# Altium schematic sheet 1_P1.schdoc: 戴尔服务器电源取电板
size 304 x 205 mm; Symbol: Altium_A4; Device: Altium_A4; Author: Tomosawa; ModifiedDate: 2024/6/10; Rule: 去除单片机影响
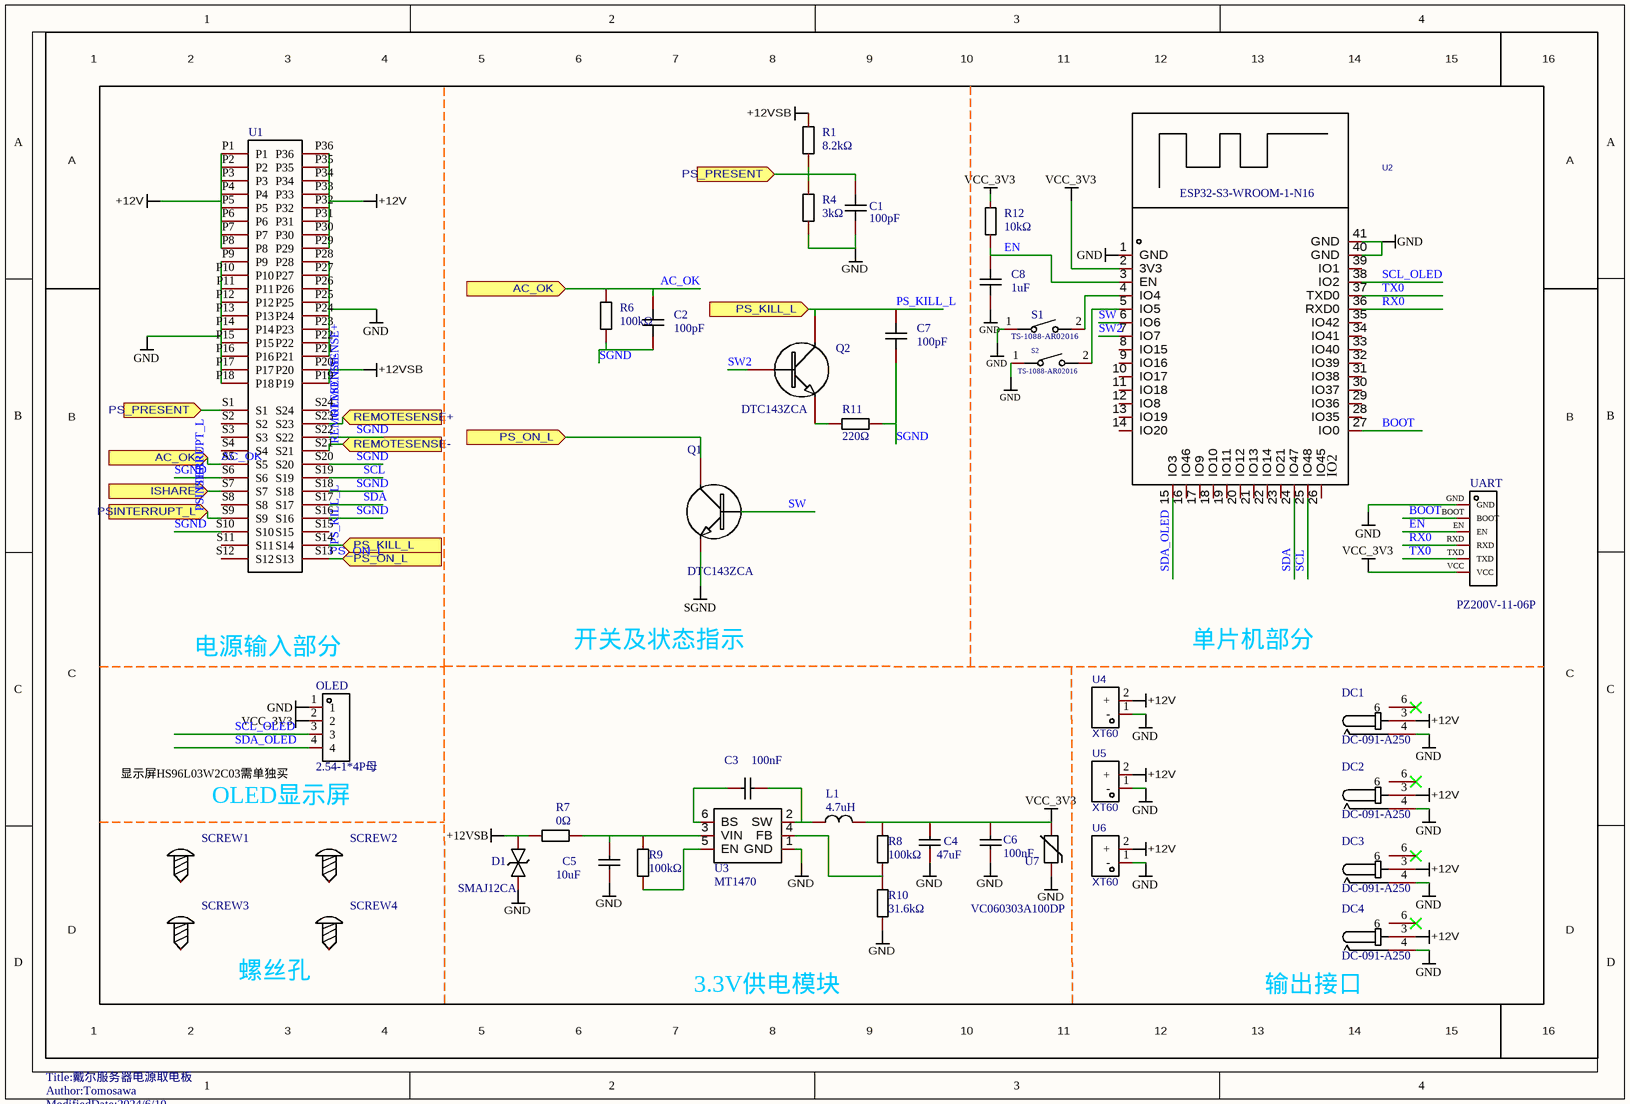
[diagram p0: 1_P1.schdoc]

## Parts
C1  100pF  [C0603]
C2  100pF  [C0603]
C3  100nF  [C0603]
C4  47uF  [C0805]
C5  10uF  [C0805]
C6  100nF  [C0603]
C7  100pF  [C0603]
C8  1uF  [C0603]
D1  SMAJ12CA  [SMA_L4.4-W2.6-LS5.0-BI]
DC1  DC-091-A250  [DC-IN-TH_DC-091-A250]
DC2  DC-091-A250  [DC-IN-TH_DC-091-A250]
DC3  DC-091-A250  [DC-IN-TH_DC-091-A250]
DC4  DC-091-A250  [DC-IN-TH_DC-091-A250]
L1  4.7uH  [IND-SMD_L3.0-W3.0_FNR30XXS]
OLED  2.54-1*4P母  [HDR-TH_4P-P2.54-V-F]
Q1  DTC143ZCA  [SOT-23-3_L2.9-W1.3-P1.90-LS2.4-BR]
Q2  DTC143ZCA  [SOT-23-3_L2.9-W1.3-P1.90-LS2.4-BR]
R1  8.2kΩ  [R0603]
R4  3kΩ  [R0603]
R6  100kΩ  [R0603]
R7  0Ω  [R0603]
R8  100kΩ  [R0603]
R9  100kΩ  [R0603]
R10  31.6kΩ  [R0603]
R11  220Ω  [R0603]
R12  10kΩ  [R0603]
S1  TS-1088-AR02016  [SW-SMD_L3.9-W3.0-P4.45]
S2  TS-1088-AR02016  [SW-SMD_L3.9-W3.0-P4.45]
SCREW1  M3螺丝  [M3螺丝]  (value not drawn)
SCREW2  M3螺丝  [M3螺丝]  (value not drawn)
SCREW3  M3螺丝  [M3螺丝]  (value not drawn)
SCREW4  M3螺丝  [M3螺丝]  (value not drawn)
U1  10114587-001LF  [10114587-001LF]  (value not drawn)
U2  ESP32-S3-WROOM-1-N16  [WIRELM-SMD_ESP32-S3-WROOM-1]
U3  MT1470  [SOT-23-6_L2.9-W1.6-P0.95-LS2.8-BR]
U4  XT60  [CONN-TH_XT60]
U5  XT60  [CONN-TH_XT60]
U6  XT60  [CONN-TH_XT60]
U7  VC060303A100DP  [R0603]
UART  PZ200V-11-06P  [6PIN-2MM-UART]

## Ports
AC_OK (in), ISHARE (in), PS_KILL_L (in), PS_ON_L (in), PS_PRESENT (in), PSINTERRUPT_L (in), REMOTESENSE+ (in), REMOTESENSE- (in)

## Nets
+12V: DC1.3 DC2.3 DC3.3 DC4.3 U1.P1 U1.P2 U1.P3 U1.P4 U1.P5 U1.P6 U1.P7 U1.P8 U1.P29 U1.P30 U1.P31 U1.P32 U1.P33 U1.P34 U1.P35 U1.P36 U4.2(+) U5.2(+) U6.2(+)
+12VSB: D1.2 R1.2 R7.2 U1.P19 U1.P20
GND: C1.2 C4.2 C5.2 C6.1 C8.1 D1.1 DC1.4 DC2.4 DC3.4 DC4.4 OLED.1 R4.1 R10.1 S1.1 S2.1 U1.P9 U1.P10 U1.P11 U1.P12 U1.P13 U1.P14 U1.P15 U1.P16 U1.P17 U1.P18 U1.P21 U1.P22 U1.P23 U1.P24 U1.P25 U1.P26 U1.P27 U1.P28 U2.1(GND) U2.40(GND) U2.41(GND) U3.1(GND) U4.1(-) U5.1(-) U6.1(-) U7.1 UART.GND
SGND: C2.1 C7.1 Q1.2(E) R6.2 R11.1 U1.S6 U1.S10 U1.S16 U1.S18 U1.S20 U1.S22
VCC_3V3: C4.1 C6.2 L1.2 OLED.2 R8.2 R12.2 U2.2(3V3) U7.2 UART.VCC
AC_OK: C2.2 R6.1 U1.S5 ; port AC_OK
BOOT: U2.27(IO0) UART.BOOT
EN: C8.2 R12.1 U2.3(EN) UART.EN
ISHARE: U1.S7 ; port ISHARE
PS_KILL_L: C7.2 Q2.3(C) U1.S14 ; port PS_KILL_L
PS_ON_L: Q1.3(C) U1.S13 ; port PS_ON_L
PS_PRESENT: C1.1 R1.1 R4.2 U1.S1 ; port PS_PRESENT
PSINTERRUPT_L: U1.S9 ; port PSINTERRUPT_L
REMOTESENSE+: U1.S23 ; port REMOTESENSE+
REMOTESENSE-: U1.S21 ; port REMOTESENSE-
RX0: U2.36(RXD0) UART.RXD
SCL: U1.S19 U2.25(IO48)
SCL_OLED: OLED.3 U2.38(IO2)
SDA: U1.S17 U2.24(IO47)
SDA_OLED: OLED.4 U2.15(IO3)
SW: Q1.1(B) U2.6(IO6)
SW2: Q2.1(B) U2.7(IO7)
TX0: U2.37(TXD0) UART.TXD
NetC3_1: C3.1 U3.6(BS)
NetC3_2: C3.2 L1.1 U3.2(SW)
NetC5_1: C5.1 R7.1 R9.2 U3.3(VIN)
NetQ2_2: Q2.2(E) R11.2
NetR8_1: R8.1 R10.2 U3.4(FB)
NetR9_1: R9.1 U3.5(EN)
NetS1_2: S1.2 U2.4(IO4)
NetS2_2: S2.2 U2.5(IO5)

Not connected (* = marked no-connect by the designer): DC1 6*; DC2 6*; DC3 6*; DC4 6*; SCREW1 1; SCREW2 1; SCREW3 1; SCREW4 1; U1 S2 S3 S4 S8 S11 S12 S15 S24; U2 8(IO15) 9(IO16) 10(IO17) 11(IO18) 12(IO8) 13(IO19) 14(IO20) 16(IO46) 17(IO9) 18(IO10) 19(IO11) 20(IO12) 21(IO13) 22(IO14) 23(IO21) 26(IO45) 28(IO35) 29(IO36) 30(IO37) 31(IO38) 32(IO39) 33(IO40) 34(IO41) 35(IO42) 39(IO1)

## Notes on the sheet
- (near U2) IO2
- 电源输入部分
- 开关及状态指示
- 单片机部分
- 显示屏HS96L03W2C03需单独买
- (near OLED) OLED显示屏
- (near SCREW4) 螺丝孔
- 3.3V供电模块
- (near DC4) 输出接口
- 1
- 2
- 3
- 4
- 5
- 6
- 7
- 8
- 9
- 10
- 11
- 12
- 13
- 14
- 15
- 16
- A
- B
- C
- D
- ModifiedDate:2024/6/10
- Author:Tomosawa
- Title:戴尔服务器电源取电板

## Library data of the parts
C1 = CC0603JRNPO9BN101: 容值:100pF;精度:±5%;额定电压:50V;材质(温度系数):NP0;; Manufacturer: YAGEO(国巨); Symbol: 100p; Add into BOM: yes; Tolerance: ±5%; Voltage Rated: 50V; Temperature Coefficient: NP0; Origin Footprint: C1206; Name: 100pF; Device: CC0603JRNPO9BN101; LCSC Part Name: 100pF ±5% 50V; Supplier Part: C14665; Manufacturer Part: CC0603JRNPO9BN101; Supplier Footprint: 0603; JLCPCB Part Class: Extended Part; Datasheet: https://atta.szlcsc.com/upload/public/pdf/source/20181008/C309499_21CC21451B82C39E3D92150FD6B30293.pdf; Supplier: LCSC; Convert to PCB: yes; Value: 100pF
C2 = CC0603JRNPO9BN101: 容值:100pF;精度:±5%;额定电压:50V;材质(温度系数):NP0;; Manufacturer: YAGEO(国巨); Symbol: CapAcitance; Add into BOM: yes; Tolerance: ±5%; Voltage Rated: 50V; Temperature Coefficient: NP0; Name: 100pF; Device: CC0603JRNPO9BN101; LCSC Part Name: 100pF ±5% 50V; Supplier Part: C14665; Manufacturer Part: CC0603JRNPO9BN101; Supplier Footprint: 0603; JLCPCB Part Class: Extended Part; Datasheet: https://atta.szlcsc.com/upload/public/pdf/source/20181008/C309499_21CC21451B82C39E3D92150FD6B30293.pdf; Supplier: LCSC; Convert to PCB: yes; Value: 100pF
C3 C6 = 0603B104K500NT: 容值:100nF;精度:±10%;额定电压:50V;材质(温度系数):X7R;; Manufacturer: FH(风华); Symbol: Cap; Add into BOM: yes; Tolerance: ±10%; Voltage Rated: 50V; Temperature Coefficient: X7R; Origin Footprint 1: 0603C; Origin Footprint 2: 0402; Name: 100nF; Device: 0603B104K500NT; LCSC Part Name: 100nF ±10% 50V; Supplier Part: C30926; Manufacturer Part: 0603B104K500NT; Supplier Footprint: 0603; JLCPCB Part Class: Extended Part; Datasheet: https://atta.szlcsc.com/upload/public/pdf/source/20200305/C486355_26A10D38EF8C2A5C37091D0039909270.pdf; Supplier: LCSC; Convert to PCB: yes; Value: 100nF; Design Item ID: Cap; Library Name: Miscellaneous Devices
C4 = CL21A476MQYNNNE: 容值:47uF;精度:±20%;额定电压:6.3V;材质(温度系数):X5R;; Manufacturer: SAMSUNG(三星); Add into BOM: yes; Tolerance: ±20%; Voltage Rated: 6.3V; Temperature Coefficient: X5R; Rated Voltage: 10V; Equivalent Series Resistance(ESR): 2.4Ω@100kHz; Origin Footprint: 1206C; Name: 47uF; Symbol: CL21A476MQYNNNE; Device: CL21A476MQYNNNE; Supplier: LCSC; Manufacturer Part: CL21A476MQYNNNE; Value: 47uF; Supplier Part: C16780; JLCPCB Part Class: Basic Part; LCSC Part Name: 47uF ±20% 6.3V; Supplier Footprint: 0805; Datasheet: https://atta.szlcsc.com/upload/public/pdf/source/20160218/1457707763339.pdf; Convert to PCB: yes; Operating Temperature: -55℃~+125℃; Design Item ID: Cap; Library Name: Miscellaneous Devices
C5 = CL21A106KAYNNNE_C15850: 容值:10uF;精度:±10%;额定电压:25V;材质(温度系数):X5R;; Manufacturer: SAMSUNG(三星); Symbol: Cap; Add into BOM: yes; Tolerance: ±10%; Voltage Rated: 25V; Temperature Coefficient: X5R; Origin Footprint: 1206C; Name: 10uF; Device: CL21A106KAYNNNE_C15850; LCSC Part Name: 10uF ±10% 25V; Supplier Part: C15850; Manufacturer Part: CL21A106KAYNNNE; Supplier Footprint: 0805; JLCPCB Part Class: Basic Part; Datasheet: https://atta.szlcsc.com/upload/public/pdf/source/20160103/1457707679302.pdf; Supplier: LCSC; Convert to PCB: yes; Value: 10uF; Design Item ID: Cap; Library Name: Miscellaneous Devices
C7 = CC0603JRNPO9BN101: 容值:100pF;精度:±5%;额定电压:50V;材质(温度系数):NP0;; Manufacturer: YAGEO(国巨); Add into BOM: yes; Tolerance: ±5%; Voltage Rated: 50V; Temperature Coefficient: NP0; Name: 100pF; Symbol: CC0603JRNPO9BN101; Device: CC0603JRNPO9BN101; Supplier: LCSC; Manufacturer Part: CC0603JRNPO9BN101; Value: 100pF; Supplier Part: C14665; JLCPCB Part Class: Extended Part; LCSC Part Name: 100pF ±5% 50V; Supplier Footprint: 0603; Datasheet: https://atta.szlcsc.com/upload/public/pdf/source/20181008/C309499_21CC21451B82C39E3D92150FD6B30293.pdf; Convert to PCB: yes
C8 = CC0603KRX5R8BB105: 容值:1uF;精度:±10%;额定电压:25V;材质(温度系数):X5R;; Manufacturer: YAGEO(国巨); Symbol: 100p; Add into BOM: yes; Tolerance: ±10%; Voltage Rated: 25V; Temperature Coefficient: X5R; Origin Footprint: C1206; Name: 1uF; Device: CC0603KRX5R8BB105; LCSC Part Name: 1uF ±10% 25V; Supplier Part: C14664; Manufacturer Part: CC0603KRX5R8BB105; Supplier Footprint: 0603; JLCPCB Part Class: Extended Part; Datasheet: https://atta.szlcsc.com/upload/public/pdf/source/20160606/1465200209684.pdf; Supplier: LCSC; Convert to PCB: yes; Value: 1uF
D1 = SMAJ12CA_C698919: 反向截止电压(Vrwm):12V;最大钳位电压:19.9V;峰值脉冲电流(Ipp)@10/1000us:20.1A;峰值脉冲功率(Ppp)@10/1000us:400W;击穿电压:13.3V;; Manufacturer: YANGJIE(扬杰); Symbol: SMAJ15CA_C1509527; Add into BOM: yes; Reverse Stand-Off Voltage (Vrwm): 12V; Maximum Clamping Voltage: 19.9V; Peak Pulse Current (Ipp)@10/1000us: 20.1A; Peak Pulse Power Dissipation (Ppp)@10/1000us: 400W; Breakdown Voltage: 13.3V; Type: TVS; Reverse Leakage Current (Ir): 1uA; Name: SMAJ12CA; Device: SMAJ12CA_C698919; LCSC Part Name: 双向TVS; Supplier Part: C698919; Manufacturer Part: SMAJ12CA; Supplier Footprint: SMA(DO-214AC); JLCPCB Part Class: Extended Part; Datasheet: https://atta.szlcsc.com/upload/public/pdf/source/20190626/C400501_E5286E6D730C560E6135F16A39AD19AD.pdf; Supplier: LCSC; Convert to PCB: yes
DC1-DC4 = DC-091-A250: 连接器类型:DC电源插座;安装方式:弯插;触点内径:2.5mm;触点外径:6.45mm;额定电流:5A;额定电压:24V;工作温度范围:-30℃~+70℃;; Manufacturer: XUNPU(讯普); Add into BOM: yes; Connector Type: DC电源插座; Inside Contact Diameter: 2.5mm; Outside Contact Diameter: 6.45mm; Current Rating (Max): 5A; Voltage Rating (Max): 24V; Name: DC-091-A250; Symbol: DC-091-A250; Device: DC-091-A250; Supplier: LCSC; Supplier Part: C720588; Manufacturer Part: DC-091-A250; JLCPCB Part Class: 扩展库; LCSC Part Name: DC电源插座 内径:2.5mm 外径:6.45mm; Supplier Footprint: 插件; Datasheet: https://atta.szlcsc.com/upload/public/pdf/source/20211022/4405C4A6464D514B1AFE6C16257EC3E0.pdf; Convert to PCB: yes; Mounting Style: 弯插; Operating Temperature Range: -30℃~+70℃
L1 = SWPA3015S4R7MT: 类型:-;电感值:4.7uH;精度:±20%;额定电流:1.09A;饱和电流(Isat):1.4A;; Manufacturer: Sunlord(顺络); Symbol: INDUCTOR; Add into BOM: yes; Tolerance: ±20%; Rated Current: 1.09A; Saturation Current (Isat): 1.4A; DC Resistance (DCR): 163mΩ; Origin Footprint: COKE_3X3A; Name: 4.7uH; Device: SWPA3015S4R7MT; LCSC Part Name: 4.7uH ±20% 1.4A; Supplier Part: C19398; Manufacturer Part: SWPA3015S4R7MT; Supplier Footprint: SMD; JLCPCB Part Class: Extended Part; Datasheet: https://atta.szlcsc.com/upload/public/pdf/source/20210916/AC798BA7E846B7D0B6818F45CD84DB0B.pdf; Supplier: LCSC; Convert to PCB: yes; Type: -; Value: 4.7uH; Ratings: -; Design Item ID: INDUCTOR; Library Name: U_PP SCH
OLED = 2.54-1*4P母: 排数:单排;总孔位数:4P;间距:2.54mm;插孔结构:1x4P;行距:-;安装类型:直插;圆孔/方孔:方孔;额定电流:3A;额定电压:-;插孔方向:顶部;塑高:-;触头材质:青铜;触头镀层:-;工作温度范围:-40℃~+105℃;焊接温度(最大值):-;; Manufacturer: BOOMELE(博穆精密); Add into BOM: yes; Number of Holes: 4P; Pitch: 2.54mm; Holes Structure: 1x4P; Circular Hole / Square Hole: 方孔; Current Rating (Max): 3A; Holes Direction: 顶部; Origin Footprint: SIP4; Name: 2.54-1*4P母; Symbol: 2.54-1*4P母; Device: 2.54-1*4P母; Supplier: LCSC; Supplier Part: C2718488; Manufacturer Part: 2.54-1*4P母; JLCPCB Part Class: Extended Part; LCSC Part Name: 间距:2.54mm 1x4P 直插; Supplier Footprint: 插件,P=2.54mm; Datasheet: https://atta.szlcsc.com/upload/public/pdf/source/20210301/C2718488_F4427B881E42CAA8DDB0B1C12B3A522C.pdf; Convert to PCB: yes; Number of Rows: 单排; Row Spacing: -; Mounting Type: 直插; Voltage Rating (Max): -; Insulation Height: -; Contact Material: 青铜; Contact Plating: -; Operating Temperature Range: -40℃~+105℃; Welding Temperature (Max): -; Design Item ID: HEADER4; Library Name: U_PP SCH
Q1 Q2 = DTC143ZCA_C15236: 功率(Pd):200mW;集射极击穿电压(Vceo):50V;晶体管类型:1个NPN-预偏置;集电极电流(Ic):100mA;; Manufacturer: CJ(江苏长电/长晶); Symbol: NPN; Add into BOM: yes; Power Dissipation (Pd): 200mW; Collector-Emitter Breakdown Voltage (Vceo): 50V; Collector Current (Ic): 100mA; Origin Footprint: SOT23; Name: DTC143ZCA; Device: DTC143ZCA_C15236; LCSC Part Name: 电流:100mA 耐压:50V; Supplier Part: C15236; Manufacturer Part: DTC143ZCA; Supplier Footprint: SOT-23; JLCPCB Part Class: Extended Part; Datasheet: https://atta.szlcsc.com/upload/public/pdf/source/20140809/1457707205046.pdf; Supplier: LCSC; Convert to PCB: yes; Transistor Type: 1个NPN-预偏置; Design Item ID: NPN; Library Name: U_PP SCH
R1 = RC0603FR-078K2L: 电阻类型:厚膜电阻;阻值:8.2kΩ;精度:±1%;功率:100mW;; Manufacturer: YAGEO(国巨); Symbol: 电阻; Add into BOM: yes; Tolerance: ±1%; Power(Watts): 100mW; Temperature Coefficient: ±100ppm/℃; Overload Voltage (Max): 75V; Name: 8.2kΩ; Device: RC0603FR-078K2L; LCSC Part Name: 8.2kΩ ±1% 100mW; Supplier Part: C114637; Manufacturer Part: RC0603FR-078K2L; Supplier Footprint: 0603; JLCPCB Part Class: Extended Part; Datasheet: https://atta.szlcsc.com/upload/public/pdf/source/20170912/C114637_1505207799594963452.pdf; Supplier: LCSC; Convert to PCB: yes; Type: 厚膜电阻; Value: 8.2kΩ; Operating Temperature Range: -55℃~+155℃
R4 = RC0603FR-073KL: 电阻类型:厚膜电阻;阻值:3kΩ;精度:±1%;功率:100mW;最大工作电压:75V;温度系数:±100ppm/℃;; Manufacturer: YAGEO(国巨); Symbol: 电阻; Add into BOM: yes; Tolerance: ±1%; Power(Watts): 100mW; Overload Voltage (Max): 75V; Name: 3kΩ; Device: RC0603FR-073KL; LCSC Part Name: 厚膜电阻 3kΩ ±1% 100mW; Supplier Part: C126358; Manufacturer Part: RC0603FR-073KL; Supplier Footprint: 0603; JLCPCB Part Class: Extended Part; Datasheet: https://atta.szlcsc.com/upload/public/pdf/source/20170914/C127450_1505359406912967677.pdf; Supplier: LCSC; Convert to PCB: yes; Type: 厚膜电阻; Value: 3kΩ; Temperature Coefficient: ±100ppm/℃; Operating Temperature Range: -55℃~+155℃
R6 = RC0603FR-071KL: 电阻类型:厚膜电阻;阻值:1kΩ;精度:±1%;功率:100mW;; Manufacturer: YAGEO(国巨); Symbol: Res2; Add into BOM: yes; Tolerance: ±1%; Power(Watts): 100mW; Temperature Coefficient: ±100ppm/℃; Overload Voltage (Max): 75V; Origin Footprint 1: 0603R; Origin Footprint 2: AXIAL-0.4; Origin Footprint 3: R0402; Origin Footprint 4: 0402; Name: 100kΩ; Device: RC0603FR-071KL; LCSC Part Name: 1kΩ ±1% 100mW; Supplier Part: C22548; Manufacturer Part: RC0603FR-071KL; Supplier Footprint: 0603; JLCPCB Part Class: Extended Part; Datasheet: https://atta.szlcsc.com/upload/public/pdf/source/20180312/7BD3618A8B6324EA6280B0497A051AB7.pdf; Supplier: LCSC; Convert to PCB: yes; Type: 厚膜电阻; Value: 100kΩ; Operating Temperature Range: -55℃~+155℃; Design Item ID: Res2; Library Name: Miscellaneous Devices
R7 = 0603WAF0000T5E: 阻值:0Ω;精度:±1%;功率:100mW;电阻类型:厚膜电阻;; Manufacturer: UNI-ROYAL(厚声); Symbol: Res2; Add into BOM: yes; Tolerance: ±1%; Power(Watts): 100mW; Overload Voltage (Max): 75V; Origin Footprint 1: 0603R; Origin Footprint 2: AXIAL-0.4; Origin Footprint 3: R0402; Origin Footprint 4: 0402; Name: 0Ω; Device: 0603WAF0000T5E; LCSC Part Name: 0Ω ±1% 100mW 厚膜电阻; Supplier Part: C21189; Manufacturer Part: 0603WAF0000T5E; Supplier Footprint: 0603; JLCPCB Part Class: Basic Part; Datasheet: https://atta.szlcsc.com/upload/public/pdf/source/20200306/C422600_1E6D84923E4A46A82E41ADD87F860B5C.pdf; Supplier: LCSC; Convert to PCB: yes; Value: 0Ω; Type: 厚膜电阻; Operating Temperature Range: -55℃~+155℃; Design Item ID: Res2; Library Name: Miscellaneous Devices
R8 R9 = RC0603FR-07100KL: 电阻类型:厚膜电阻;阻值:100kΩ;精度:±1%;功率:100mW;温度系数:±100ppm/℃;; Manufacturer: YAGEO(国巨); Symbol: Res2; Add into BOM: yes; Tolerance: ±1%; Power(Watts): 100mW; Overload Voltage (Max): 75V; Origin Footprint 1: 0603R; Origin Footprint 2: AXIAL-0.4; Origin Footprint 3: R0402; Name: 100kΩ; Device: RC0603FR-07100KL; LCSC Part Name: 厚膜电阻 100kΩ ±1% 100mW; Supplier Part: C14675; Manufacturer Part: RC0603FR-07100KL; Supplier Footprint: 0603; JLCPCB Part Class: Extended Part; Datasheet: https://atta.szlcsc.com/upload/public/pdf/source/20140324/1457707028752.pdf; Supplier: LCSC; Convert to PCB: yes; Type: 厚膜电阻; Value: 100kΩ; Temperature Coefficient: ±100ppm/℃; Operating Temperature Range: -55℃~+155℃; Design Item ID: Res2; Library Name: Miscellaneous Devices
R10 = 0603WAF3162T5E: 阻值:31.6kΩ;精度:±1%;功率:100mW;温度系数:±100ppm/℃;电阻类型:厚膜电阻;; Manufacturer: UNI-ROYAL(厚声); Symbol: Res2; Add into BOM: yes; Tolerance: ±1%; Power(Watts): 100mW; Overload Voltage (Max): 75V; Origin Footprint 1: 0603R; Origin Footprint 2: AXIAL-0.4; Origin Footprint 3: R0402; Name: 31.6kΩ; Device: 0603WAF3162T5E; LCSC Part Name: 31.6kΩ ±1% 100mW 厚膜电阻; Supplier Part: C25967; Manufacturer Part: 0603WAF3162T5E; Supplier Footprint: 0603; JLCPCB Part Class: Extended Part; Datasheet: https://atta.szlcsc.com/upload/public/pdf/source/20200306/C422600_1E6D84923E4A46A82E41ADD87F860B5C.pdf; Supplier: LCSC; Convert to PCB: yes; Value: 31.6kΩ; Temperature Coefficient: ±100ppm/℃; Type: 厚膜电阻; Operating Temperature Range: -55℃~+155℃; Design Item ID: Res2; Library Name: Miscellaneous Devices
R11 = 0603WAF2200T5E: 电阻类型:厚膜电阻;阻值:220Ω;精度:±1%;功率:100mW;最大工作电压:75V;温度系数:±100ppm/℃;; Manufacturer: UNI-ROYAL(厚声); Add into BOM: yes; Tolerance: ±1%; Power(Watts): 100mW; Overload Voltage (Max): 75V; Name: 220Ω; Symbol: 0603WAF2200T5E; Device: 0603WAF2200T5E; Supplier: LCSC; Manufacturer Part: 0603WAF2200T5E; Supplier Part: C22962; Value: 220Ω; JLCPCB Part Class: Basic Part; LCSC Part Name: 220Ω ±1% 100mW 厚膜电阻; Supplier Footprint: 0603; Datasheet: https://atta.szlcsc.com/upload/public/pdf/source/20200306/C422600_1E6D84923E4A46A82E41ADD87F860B5C.pdf; Convert to PCB: yes; Type: 厚膜电阻; Temperature Coefficient: ±100ppm/℃; Operating Temperature Range: -55℃~+155℃
R12 = 0603WAF1002T5E: 电阻类型:厚膜电阻;阻值:10kΩ;精度:±1%;功率:100mW;最大工作电压:75V;温度系数:±100ppm/℃;; Manufacturer: UNI-ROYAL(厚声); Symbol: 电阻; Add into BOM: yes; Tolerance: ±1%; Power(Watts): 100mW; Overload Voltage (Max): 75V; Name: 10kΩ; Device: 0603WAF1002T5E; LCSC Part Name: 厚膜电阻 10kΩ ±1% 100mW; Supplier Part: C25804; Manufacturer Part: 0603WAF1002T5E; Supplier Footprint: 0603; JLCPCB Part Class: Basic Part; Datasheet: https://atta.szlcsc.com/upload/public/pdf/source/20200306/C422600_1E6D84923E4A46A82E41ADD87F860B5C.pdf; Supplier: LCSC; Convert to PCB: yes; Value: 10kΩ; Temperature Coefficient: ±100ppm/℃; Type: 厚膜电阻; Operating Temperature Range: -55℃~+155℃
S1 S2 = TS-1088-AR02016: 电路结构:单刀单掷;按钮形状:圆形按钮;作用力:160gf;安装方式:立贴;开关长度:4mm;开关宽度:3mm;开关高度:2mm;带支架:不带;触点电流:50mA;额定电压(DC):12V;绝缘电阻:100MΩ;机械寿命:10万次;; Manufacturer: XUNPU(讯普); Add into BOM: yes; Circuit: 单刀单掷; Actuator Style: 圆形按钮; Switch Length: 4mm; Switch Width: 3mm; Switch Height: 2mm; Strike Gundam: 不带; Contact Current: 50mA; Voltage Rating (DC): 12V; Insulation Resistance: 100MΩ; Actuator/Cap Color: 黑色; Operating Force: 160gf; Pin Style: SMD接片; Mechanical Life: 10万次; Origin Footprint: KEY-3.6X6; Name: TS-1088-AR02016; Symbol: TS-1088-AR02016; Device: TS-1088-AR02016; Supplier: LCSC; Supplier Part: C720477; Manufacturer Part: TS-1088-AR02016; JLCPCB Part Class: Extended Part; LCSC Part Name: 4*3*2mm 立贴 轻触开关; Supplier Footprint: SMD; Datasheet: https://atta.szlcsc.com/upload/public/pdf/source/20200810/C720475_60D09DD6C54279ADDB2DC25100F1CC11.pdf; Convert to PCB: yes; Mounting Style: 立贴; Operating Temperature: -30℃~+80℃; With Lamp: -; Design Item ID: SW-PB; Library Name: U_PP SCH
SCREW1-SCREW4 = M3螺丝: Symbol: 螺丝孔; Convert to PCB: yes; Device: M3螺丝; Add into BOM: yes; Supplier Footprint: 插件
U1 = 10114587-001LF: DELL电源金手指连接器36P24S 立式; Add into BOM: yes; Symbol: 10114587-001LF; Device: 10114587-001LF; Convert to PCB: yes
U2 = ESP32-S3-WROOM-1-N16: Manufacturer: ESPRESSIF(乐鑫); Symbol: ESP32-S3-WROOM-1(N16); Add into BOM: yes; Designer: U?; Name: ESP32-S3-WROOM-1-N16; Device: ESP32-S3-WROOM-1-N16; LCSC Part Name: 通用型Wi-Fi+低功耗蓝牙MCU模组; Supplier Part: C2913199; Manufacturer Part: ESP32-S3-WROOM-1-N16; Supplier Footprint: SMD,18x25.5mm; JLCPCB Part Class: Extended Part; Datasheet: https://atta.szlcsc.com/upload/public/pdf/source/20220628/A2AC12B3C87735CAEB7EBE2DBE80936C.pdf; Supplier: LCSC; Convert to PCB: yes; Origin Footprint: WIRELM-SMD_ESP32-S3-WROOM-1; Design Item ID: ESP32-S3-WROOM-1(N16)
U3 = MT1470: 功能类型:降压型;输入电压:-;输出电流(最大值):-;; Manufacturer: 西安航天民芯; Add into BOM: yes; Function: 降压型; Switch tube (built-in/external): 内置; Origin Footprint: SOT23-6; Name: MT1470; Symbol: MT1470; Device: MT1470; LCSC Part Name: 停产; Supplier Part: C181781; Manufacturer Part: MT1470; Supplier Footprint: SOT-23-6; JLCPCB Part Class: Extended Part; Datasheet: https://atta.szlcsc.com/upload/public/pdf/source/20210917/0B5B51B60596D99E36E81A9EF9D9BC0F.pdf; Supplier: LCSC; Convert to PCB: yes; Input Voltage: -; Output Current (Max): -; Switching Frequency: -; Synchronous Rectification: -; Number of Outputs: -; Topology: -; Design Item ID: MT1470; Library Name: U_PP SCH
U4-U6 = XT60: 模型锂电连接器 XT60-M; Manufacturer: AMASS(艾迈斯); Add into BOM: yes; Brand: 艾迈斯; Model: XT60PW-M; InterfaceType: 公头; Origin Footprint: TH_2P-XT60PW-F; Name: XT60; Symbol: XT60; Device: XT60; LCSC Part Name: AMASS(艾迈斯) XT60模型插头 3.5mm镀金香蕉头公头（电调端）XT60-M; Supplier Part: C98733; Manufacturer Part: XT60; Supplier Footprint: -; JLCPCB Part Class: Extended Part; Datasheet: https://atta.szlcsc.com/upload/public/pdf/source/20170606/1496716524919.pdf; Supplier: LCSC; Convert to PCB: yes; Power: -; Output: -; Input: -; Size: -; Interface: -; Type: 卧式插头; Colour: 黄色; MaximumCurrent: -; RatedVoltage: -; Type1: -; NumberOfUSBHoles: -; MetalMaterial: -; InsulationMaterial: -; RatedCurrent: -; RecommendedWireGauge: -; FlameRetardantGrade: -; contact resistance: -; Belt length: -; specifications: -; Design Item ID: XT60PW-F
U7 = VC060303A100DP: 压敏电压:5V;钳位电压:-;最大工作电压(DC):3.3V;最大工作电压(AC):2.3V;; Manufacturer: Kyocera AVX; Add into BOM: yes; Varistor Voltage: 5V; Allowable Voltage (DC): 3.3V; Allowable Voltage (AC): 2.3V; Peak Current: 30A; Maximum Energy: 0.1J; Typical Capatitance: 1.45nF@1kHz; Name: VC060303A100DP; Symbol: VC060303A100DP; Device: VC060303A100DP; Supplier: LCSC; Supplier Part: C2655386; Manufacturer Part: VC060303A100DP; JLCPCB Part Class: Extended Part; LCSC Part Name: 0.1焦耳 0603压敏电阻; Supplier Footprint: 0603; Datasheet: https://atta.szlcsc.com/upload/public/pdf/source/20230606/F25ABC06DA1414494AF73C023401BE98.pdf; Convert to PCB: yes; Clamping Voltage: -
UART = PZ200V-11-06P: 插针结构:1x6P;间距:2mm;行距:-;圆针/方针:方针;安装类型:直插;排数:单排;总PIN位数:6P;额定电流:-;额定电压:-;配合针长度:3.9mm;塑高:2mm;端接针长度:2.8mm;触头材质:黄铜;触头镀层:-;工作温度范围:-40℃~+105℃;焊接温度(最大值):-;颜色:黑色;; Manufacturer: XFCN(兴飞); Add into BOM: yes; Pin Structure: 1x6P; Pitch: 2mm; Circluar Pins/Square Pins: 方针; Pins Structure: 1x3P; Number of PINs Per Row: 3; Reference Series: PH; Origin Footprint: SIP3; Name: PZ200V-11-06P; Symbol: PZ200V-11-06P; Device: PZ200V-11-06P; LCSC Part Name: 间距:2mm 1x6P 直插 方针; Supplier Part: C541860; Manufacturer Part: PZ200V-11-06P; Supplier Footprint: 插件,P=2mm; JLCPCB Part Class: Extended Part; Datasheet: https://atta.szlcsc.com/upload/public/pdf/source/20200518/C541858_7610F54454E936EFCDE06B655DF7C837.pdf; Supplier: LCSC; Convert to PCB: yes; Row Spacing: -; Mounting Type: 直插; Number of Rows: 单排; Number of Pins: 6P; Current Rating (Max): -; Voltage Rating (Max): -; Length of Mating Pin: 3.9mm; Insulation Height: 2mm; Length of End Connection Pin: 2.8mm; Contact Material: 黄铜; Contact Plating: -; Operating Temperature Range: -40℃~+105℃; Soldering Temperature(Max): -; Color: 黑色; Mounting Style: -; Design Item ID: HEADER 3; Library Name: U_PP SCH